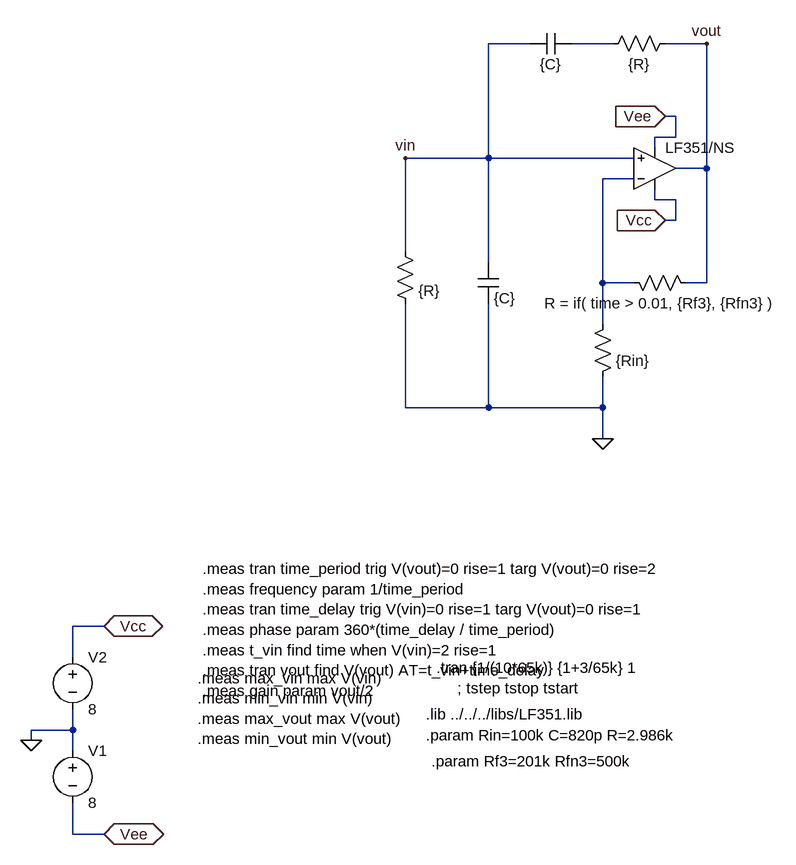
[diagram p0: schematic complete_theorical.asc]
complete_theorical.asc, the LTspice schematic file:
Version 4
SHEET 1 928 1196
WIRE 64 -128 0 -128
WIRE 192 -128 128 -128
WIRE 336 -128 272 -128
WIRE 288 -16 272 -16
WIRE 288 16 288 -16
WIRE 288 16 256 16
WIRE 256 32 256 16
WIRE 0 48 0 -128
WIRE 0 48 -128 48
WIRE 224 48 0 48
WIRE 336 64 336 -128
WIRE 336 64 288 64
WIRE 224 80 176 80
WIRE 256 112 256 96
WIRE 288 112 256 112
WIRE 288 144 288 112
WIRE 288 144 272 144
WIRE -128 192 -128 48
WIRE 0 208 0 48
WIRE 176 240 176 80
WIRE 224 240 176 240
WIRE 336 240 336 64
WIRE 336 240 304 240
WIRE 176 304 176 240
WIRE -128 432 -128 272
WIRE 0 432 0 272
WIRE 0 432 -128 432
WIRE 176 432 176 384
WIRE 176 432 0 432
WIRE 176 480 176 432
WIRE -592 768 -640 768
WIRE -640 816 -640 768
WIRE -640 928 -640 896
WIRE -640 928 -704 928
WIRE -704 944 -704 928
WIRE -640 960 -640 928
WIRE -640 1088 -640 1040
WIRE -592 1088 -640 1088
FLAG 272 144 Vcc
IOPIN 272 144 In
FLAG 272 -16 Vee
IOPIN 272 -16 In
FLAG 176 480 0
FLAG -704 944 0
FLAG -592 768 Vcc
IOPIN -592 768 BiDir
FLAG -592 1088 Vee
IOPIN -592 1088 BiDir
FLAG 336 -128 vout
FLAG -128 48 vin
SYMBOL opamp2 256 128 M180
WINDOW 0 16 32 Invisible 2
SYMATTR InstName U1
SYMATTR Value LF351/NS
SYMBOL res 320 256 M270
WINDOW 0 32 56 Invisible 2
WINDOW 3 0 56 VBottom 2
SYMATTR InstName R1
SYMATTR Value R = if( time > 0.01, {Rf3}, {Rfn3} )
SYMBOL res 160 400 M180
WINDOW 0 36 76 Invisible 2
WINDOW 3 36 40 Left 2
SYMATTR InstName R2
SYMATTR Value {Rin}
SYMBOL res -144 176 R0
WINDOW 0 36 40 Invisible 2
SYMATTR InstName R3
SYMATTR Value {R}
SYMBOL cap -16 208 R0
WINDOW 0 24 8 Invisible 2
SYMATTR InstName C1
SYMATTR Value {C}
SYMBOL res 288 -144 R90
WINDOW 0 0 56 Invisible 2
WINDOW 3 32 56 VTop 2
SYMATTR InstName R4
SYMATTR Value {R}
SYMBOL cap 128 -144 R90
WINDOW 0 0 32 Invisible 2
WINDOW 3 32 32 VTop 2
SYMATTR InstName C2
SYMATTR Value {C}
SYMBOL voltage -640 944 R0
SYMATTR InstName V1
SYMATTR Value 8
SYMBOL voltage -640 800 R0
SYMATTR InstName V2
SYMATTR Value 8
TEXT -96 904 Left 2 !.lib ../../../libs/LF351.lib
TEXT -96 936 Left 2 !.param Rin=100k C=820p R=2.986k
TEXT -80 832 Left 2 !.tran {1/(10*65k)} {1+3/65k} 1
TEXT -48 864 Left 2 !; tstep tstop tstart
TEXT -88 976 Left 2 !.param Rf3=201k Rfn3=500k
TEXT -448 848 Left 2 !.meas max_vin max V(vin)\n.meas min_vin min V(vin)\n.meas max_vout max V(vout)\n.meas min_vout min V(vout)
TEXT -440 680 Left 2 !.meas tran time_period trig V(vout)=0 rise=1 targ V(vout)=0 rise=2\n.meas frequency param 1/time_period\n.meas tran time_delay trig V(vin)=0 rise=1 targ V(vout)=0 rise=1\n.meas phase param 360*(time_delay / time_period)\n.meas t_vin find time when V(vin)=2 rise=1\n.meas tran vout find V(vout) AT=t_vin+time_delay\n.meas gain param vout/2

The netlist it stands for:
* complete_theorical.asc
XU1 vin N002 Vcc Vee vout LF351/NS  ; pins In+ In- V+ V- OUT
R1 vout N002 R = if( time > 0.01, {Rf3}, {Rfn3} )
R2 0 N002 {Rin}
R3 vin 0 {R}
C1 vin 0 {C}
R4 vout N001 {R}
C2 N001 vin {C}
V1 0 Vee 8
V2 Vcc 0 8
.lib ../../../libs/LF351.lib
.param Rin=100k C=820p R=2.986k
.tran {1/(10*65k)} {1+3/65k} 1
; tstep tstop tstart
.param Rf3=201k Rfn3=500k
.meas max_vin max V(vin)
.meas min_vin min V(vin)
.meas max_vout max V(vout)
.meas min_vout min V(vout)
.meas tran time_period trig V(vout)=0 rise=1 targ V(vout)=0 rise=2
.meas frequency param 1/time_period
.meas tran time_delay trig V(vin)=0 rise=1 targ V(vout)=0 rise=1
.meas phase param 360*(time_delay / time_period)
.meas t_vin find time when V(vin)=2 rise=1
.meas tran vout find V(vout) AT=t_vin+time_delay
.meas gain param vout/2
.backanno
.end